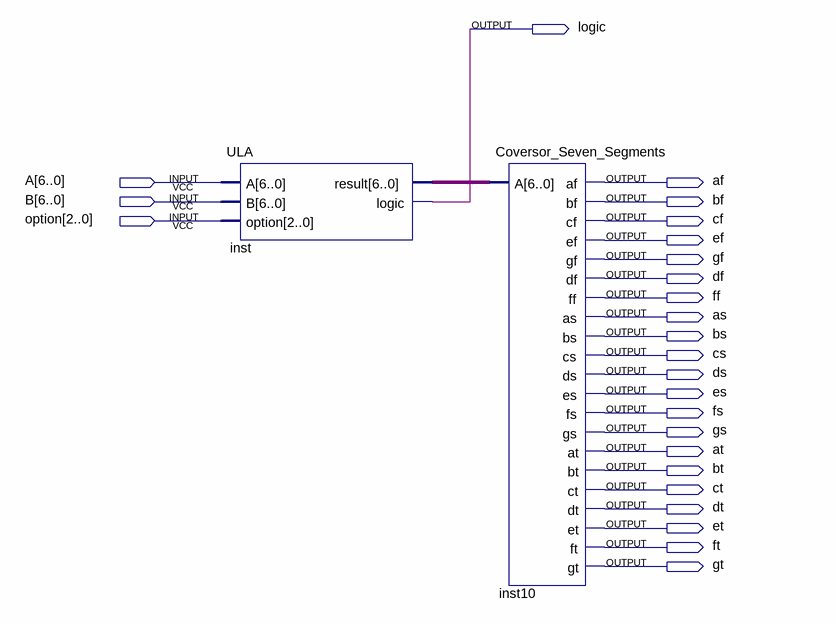
[diagram p0: schematic sheet]
// Quartus schematic ULA_Seven_Segments_output.bdf as structural Verilog: 2 symbols, 25 pins
module ULA_Seven_Segments_output (
  input  [6:0] A,
  input  [6:0] B,
  input  [2:0] option,
  output \logic ,
  output af,
  output bf,
  output cf,
  output ef,
  output gf,
  output df,
  output ff,
  output as,
  output bs,
  output cs,
  output ds,
  output es,
  output fs,
  output gs,
  output at,
  output bt,
  output ct,
  output dt,
  output et,
  output ft,
  output gt
);

  wire [6:0] inst_result;

  ULA inst (.A(A), .B(B), .option(option), .result(inst_result), .\logic (\logic ));
  Coversor_Seven_Segments inst10 (
    .A(inst_result), .af(af), .bf(bf), .cf(cf), .ef(ef), .gf(gf), .df(df), .ff(ff), .as(as), .bs(bs),
    .cs(cs), .ds(ds), .es(es), .fs(fs), .gs(gs), .at(at), .bt(bt), .ct(ct), .dt(dt), .et(et), .ft(ft), .gt(gt));
endmodule
